# EAGLE schematic shield (EAGLE 6.5.0)

## Sheet 1 of 4: Supply
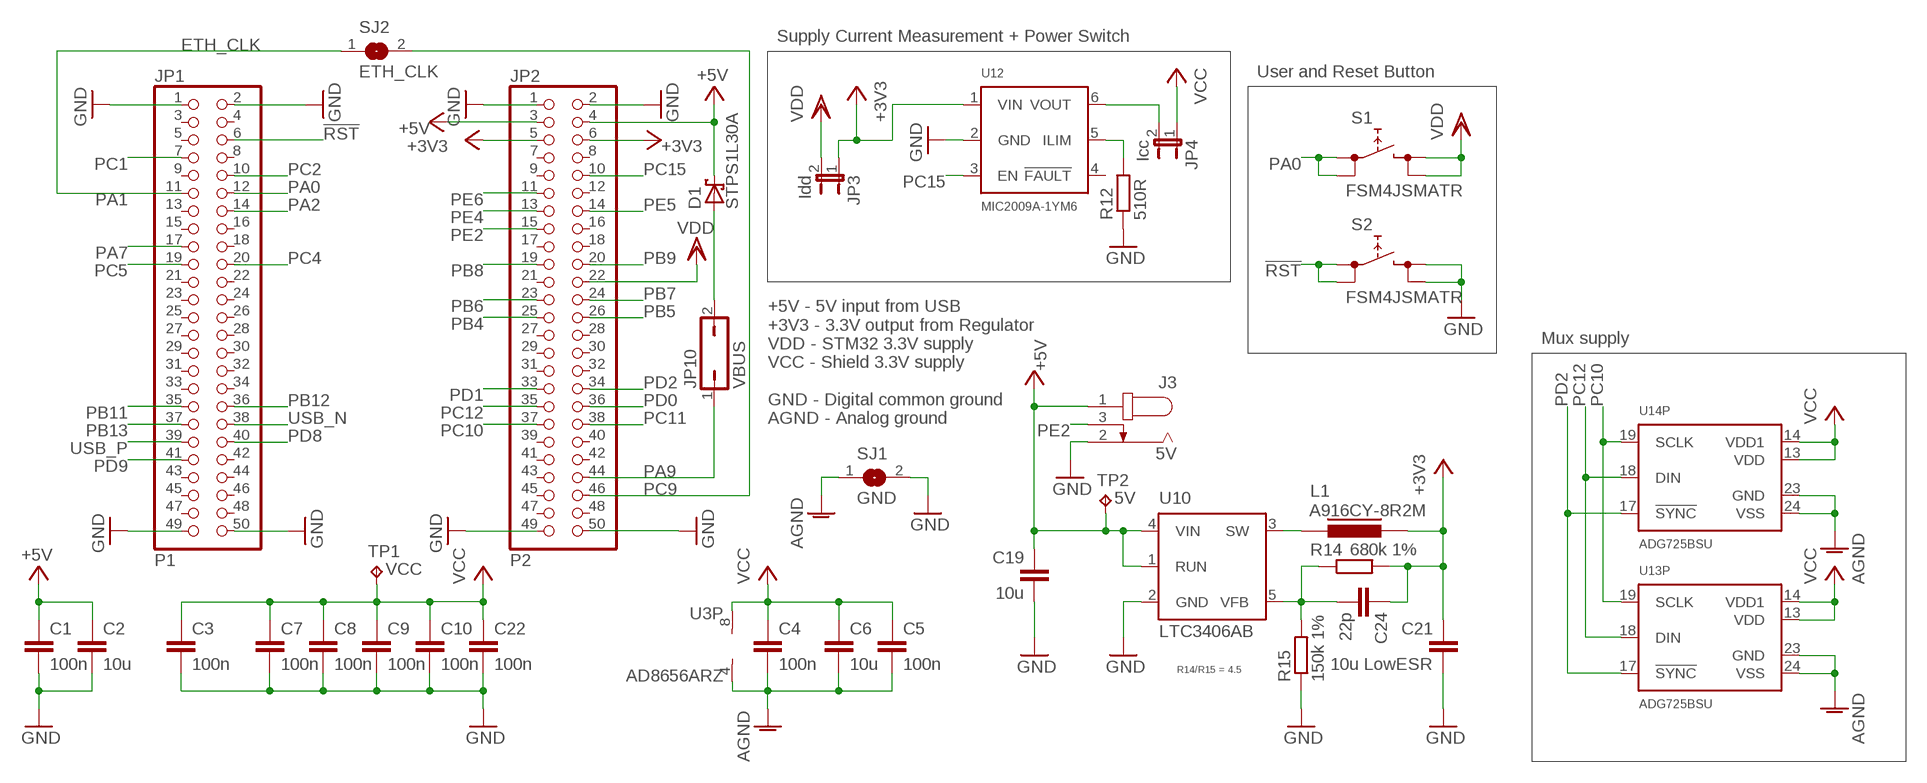
[diagram p0: schematic, sheet 1]

### Parts
C1  100n  C-EUC0603  [C0603]
C2  10u  C-EUC0603  [C0603]
C3  100n  C-EUC0603  [C0603]
C4  100n  C-EUC0603  [C0603]
C5  100n  C-EUC0603  [C0603]
C6  10u  C-EUC0603  [C0603]
C7  100n  C-EUC0603  [C0603]
C8  100n  C-EUC0603  [C0603]
C9  100n  C-EUC0603  [C0603]
C10  100n  C-EUC0603  [C0603]
C19  10u  C-EUC3216  [C3216]
C21  10u LowESR  C-EUC3216  [C3216]
C22  100n  C-EUC0603  [C0603]
C24  22p  C-EUC0603  [C0603]
D1  STPS1L30A  [DO214AC]
J3  5V  JACK-PLUG-S2.5  [JACK-SMD2.5]
JP1  P1  PINHD-2X25-F  [2X25-F]
JP2  P2  PINHD-2X25-F  [2X25-F]
JP3  Idd  JP1E  [JP1]
JP4  Icc  JP1E  [JP1]
JP10  VBUS  JP1Q  [JP1]
L1  A916CY-8R2M  [D63CB]
R12  510R  R-EU_R0603  [R0603]
R14  680k 1%  R-EU_R0603  [R0603]
R15  150k 1%  R-EU_R0603  [R0603]
S1  FSM4JSMATR  [FSM]
S2  FSM4JSMATR  [FSM]
SJ1  GND  SJ  [SJ]
SJ2  ETH_CLK  SJ  [SJ]
TP1  TPTP20R  [TP20R]
TP2  TPTP20R  [TP20R]
U3  AD8656ARZ  [SOIC8]
U10  LTC3406AB  [TSOT23-5]
U12  MIC2009A-1YM6  [SOT23-6]
U13  ADG725BSU  [TQFP48]
U14  ADG725BSU  [TQFP48]

### Nets
!RST: JP1.6 S2.1 S2.2
+3V3 [supply]: C21.1 C24.1 JP2.5 JP2.6 JP3.1 L1.2 R14.2 U12.1(VIN)
+5V [supply]: C1.1 C2.1 C19.1 D1.C J3.1 JP2.3 JP2.4 TP2.TP U10.1(RUN) U10.4(VIN) ; also sheet 4
AGND [supply]: C4.2 C5.2 C6.2 SJ1.1 U3.4(P:V-) U13.23(P:GND) U13.24(P:VSS) U14.23(P:GND) U14.24(P:VSS) ; also sheet 2
ETH_CLK: JP1.11 SJ2.1 ; also sheet 4
GND [supply]: C1.2 C2.2 C3.2 C7.2 C8.2 C9.2 C10.2 C19.2 C21.2 C22.2 J3.2 JP1.1 JP1.2 JP1.49 JP1.50 JP2.1 JP2.2 JP2.49 JP2.50 R12.1 R15.1 S2.3 S2.4 SJ1.2 U10.2(GND) U12.2(GND) ; also sheet 2,3,4
N$36: JP4.2 U12.6(VOUT)
N$37: D1.A JP10.2
N$38: R12.2 U12.5(ILIM)
N$40 [supply]: C24.2 R14.1 R15.2 U10.5(VFB)
N$41 [supply]: L1.1 U10.3(SW)
PA0: JP1.12 S1.1 S1.2
PA2: JP1.14 ; also sheet 4
PA7: JP1.17 ; also sheet 4
PA9: JP2.44 JP10.1
PB4: JP2.25 ; also sheet 2
PB5: JP2.26 ; also sheet 2
PB6: JP2.23 ; also sheet 2,3,4
PB7: JP2.24 ; also sheet 2
PB8: JP2.19 ; also sheet 2
PB9: JP2.20 ; also sheet 2,3,4
PB11: JP1.35 ; also sheet 4
PB12: JP1.36 ; also sheet 4
PB13: JP1.37 ; also sheet 4
PC1: JP1.7 ; also sheet 4
PC2: JP1.10 ; also sheet 2
PC4: JP1.20 ; also sheet 4
PC5: JP1.19 ; also sheet 4
PC9: JP2.46 SJ2.2
PC10: JP2.37 U13.19(P:SCLK) U14.19(P:SCLK) ; also sheet 3
PC11: JP2.38 ; also sheet 3
PC12: JP2.35 U13.18(P:DIN) U14.18(P:DIN) ; also sheet 3
PC15: JP2.10 U12.3(EN)
PD0: JP2.36 ; also sheet 3
PD1: JP2.33 ; also sheet 3
PD2: JP2.34 U13.17(P:!SYNC) U14.17(P:!SYNC)
PD8: JP1.40 ; also sheet 4
PD9: JP1.41 ; also sheet 4
PE2: J3.3 JP2.15
PE4: JP2.13 ; also sheet 2
PE5: JP2.14 ; also sheet 2
PE6: JP2.11 ; also sheet 2
USB_N: JP1.38 ; also sheet 4
USB_P: JP1.39 ; also sheet 4
VCC [supply]: C3.1 C4.1 C5.1 C6.1 C7.1 C8.1 C9.1 C10.1 C22.1 JP4.1 TP1.TP U3.8(P:V+) U13.13(P:VDD) U13.14(P:VDD1) U14.13(P:VDD) U14.14(P:VDD1) ; also sheet 2,3,4
VDD [supply]: JP2.22 JP3.2 S1.3 S1.4 ; also sheet 4
Unconnected: JP1.3 JP1.4 JP1.5 JP1.8 JP1.9 JP1.13 JP1.15 JP1.16 JP1.18 JP1.21 JP1.22 JP1.23 JP1.24 JP1.25 JP1.26 JP1.27 JP1.28 JP1.29 JP1.30 JP1.31 JP1.32 JP1.33 JP1.34 JP1.42 JP1.43 JP1.44 JP1.45 JP1.46 JP1.47 JP1.48 JP2.7 JP2.8 JP2.9 JP2.12 JP2.16 JP2.17 JP2.18 JP2.21 JP2.27 JP2.28 JP2.29 JP2.30 JP2.31 JP2.32 JP2.39 JP2.40 JP2.41 JP2.42 JP2.43 JP2.45 JP2.47 JP2.48 U12.4(!FAULT)

### Notes on the sheet
- Supply Current Measurement + Power Switch
- User and Reset Button
- PA1
- Mux supply
- +5V - 5V input from USB
  +3V3 - 3.3V output from Regulator
  VDD - STM32 3.3V supply
  VCC - Shield 3.3V supply
  
  GND - Digital common ground
  AGND - Analog ground
- R14/R15 = 4.5

## Sheet 2 of 4: AD5933
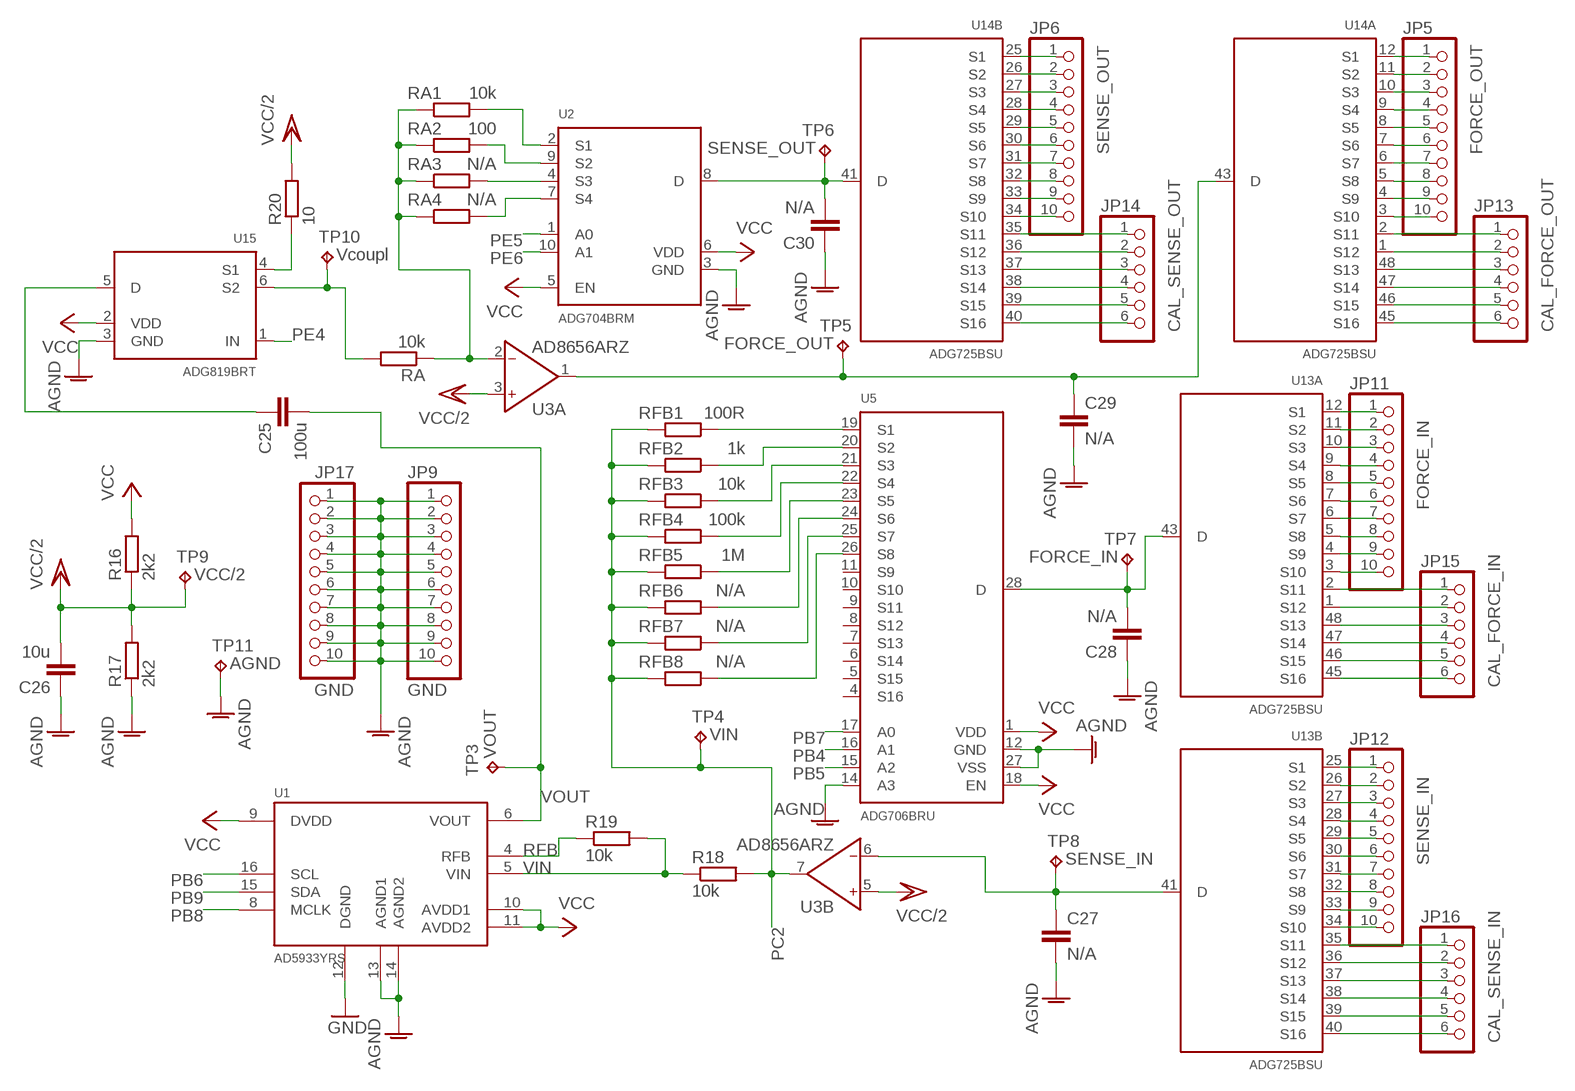
[diagram p1: schematic, sheet 2]

### Parts
C25  100u  C-EUC1206  [C1206]
C26  10u  C-EUC0603  [C0603]
C27  N/A  C-EUC0805  [C0805]
C28  N/A  C-EUC0805  [C0805]
C29  N/A  C-EUC0805  [C0805]
C30  N/A  C-EUC0805  [C0805]
JP5  FORCE_OUT  PINHD-1X10  [1X10]
JP6  SENSE_OUT  PINHD-1X10  [1X10]
JP9  GND  PINHD-1X10  [1X10]
JP11  FORCE_IN  PINHD-1X10  [1X10]
JP12  SENSE_IN  PINHD-1X10  [1X10]
JP13  CAL_FORCE_OUT  PINHD-1X6  [1X06]
JP14  CAL_SENSE_OUT  PINHD-1X6  [1X06]
JP15  CAL_FORCE_IN  PINHD-1X6  [1X06]
JP16  CAL_SENSE_IN  PINHD-1X6  [1X06]
JP17  GND  PINHD-1X10  [1X10]
R16  2k2  R-EU_R0603  [R0603]
R17  2k2  R-EU_R0603  [R0603]
R18  10k  R-EU_R0603  [R0603]
R19  10k  R-EU_R0603  [R0603]
R20  10  R-EU_R0603  [R0603]
RA  10k  R-EU_R0603  [R0603]
RA1  10k  R-EU_R0603  [R0603]
RA2  100  R-EU_R0603  [R0603]
RA3  N/A  R-EU_R0603  [R0603]
RA4  N/A  R-EU_R0603  [R0603]
RFB1  100R  R-EU_R0603  [R0603]
RFB2  1k  R-EU_R0603  [R0603]
RFB3  10k  R-EU_R0603  [R0603]
RFB4  100k  R-EU_R0603  [R0603]
RFB5  1M  R-EU_R0603  [R0603]
RFB6  N/A  R-EU_R0603  [R0603]
RFB7  N/A  R-EU_R0603  [R0603]
RFB8  N/A  R-EU_R0603  [R0603]
TP3  TPTP20R  [TP20R]
TP4  TPTP20R  [TP20R]
TP5  TPTP20R  [TP20R]
TP6  TPTP20R  [TP20R]
TP7  TPTP20R  [TP20R]
TP8  TPTP20R  [TP20R]
TP9  TPTP20R  [TP20R]
TP10  TPTP20R  [TP20R]
TP11  TPPAD1-13  [P1-13]
U1  AD5933YRS  [SSOP16]
U2  ADG704BRM  [MSOP10]
U5  ADG706BRU  [TSSOP28]
U15  ADG819BRT  [SOT23-6]

### Nets
AGND [supply]: C26.1 C27.2 C28.1 C29.2 C30.1 JP9.1 JP9.2 JP9.3 JP9.4 JP9.5 JP9.6 JP9.7 JP9.8 JP9.9 JP9.10 JP17.1 JP17.2 JP17.3 JP17.4 JP17.5 JP17.6 JP17.7 JP17.8 JP17.9 JP17.10 R17.1 TP11.TP U1.13(AGND1) U1.14(AGND2) U2.3(GND) U5.12(GND) U5.14(A3) U5.27(VSS) U15.3(GND) ; also sheet 1
GND [supply]: U1.12(DGND) ; also sheet 1,3,4
N$2: RA.2 TP10.TP U15.6(S2)
N$3 [analog]: RA1.1 RA2.1 RA3.1 RA4.1 RA.1 U3.2(A:IN-)
N$4 [analog]: RA3.2 U2.4(S3)
N$5 [analog]: RA4.2 U2.7(S4)
N$6 [analog]: RFB1.1 U5.19(S1)
N$7 [analog]: RFB2.1 U5.20(S2)
N$8 [analog]: RFB3.1 U5.21(S3)
N$9 [analog]: RFB4.1 U5.22(S4)
N$10 [analog]: RFB5.1 U5.23(S5)
N$11 [analog]: RFB6.1 U5.24(S6)
N$12 [analog]: C27.1 TP8.TP U3.6(B:IN-) U13.41(B:D)
N$13 [analog]: C28.2 TP7.TP U5.28(D) U13.43(A:D)
N$14 [analog]: C29.1 TP5.TP U3.1(A:OUT) U14.43(A:D)
N$15 [analog]: C30.2 TP6.TP U2.8(D) U14.41(B:D)
N$16 [analog]: JP12.1 U13.25(B:S1)
N$17 [analog]: JP12.2 U13.26(B:S2)
N$18 [analog]: JP12.3 U13.27(B:S3)
N$19 [analog]: JP12.4 U13.28(B:S4)
N$42 [analog]: JP12.5 U13.29(B:S5)
N$43 [analog]: JP12.6 U13.30(B:S6)
N$44 [analog]: JP12.7 U13.31(B:S7)
N$45 [analog]: JP12.8 U13.32(B:S8)
N$46 [analog]: JP12.9 U13.33(B:S9)
N$47 [analog]: JP12.10 U13.34(B:S10)
N$48 [analog]: JP11.1 U13.12(A:S1)
N$49 [analog]: JP11.2 U13.11(A:S2)
N$50 [analog]: JP11.3 U13.10(A:S3)
N$51 [analog]: JP11.4 U13.9(A:S4)
N$52 [analog]: JP11.5 U13.8(A:S5)
N$53 [analog]: JP11.6 U13.7(A:S6)
N$54 [analog]: JP11.7 U13.6(A:S7)
N$55 [analog]: JP11.8 U13.5(A:S8)
N$56 [analog]: JP11.9 U13.4(A:S9)
N$57 [analog]: JP11.10 U13.3(A:S10)
N$58 [analog]: JP5.1 U14.12(A:S1)
N$59 [analog]: JP5.2 U14.11(A:S2)
N$60 [analog]: JP5.3 U14.10(A:S3)
N$61 [analog]: JP5.4 U14.9(A:S4)
N$62 [analog]: JP5.5 U14.8(A:S5)
N$63 [analog]: JP5.6 U14.7(A:S6)
N$64 [analog]: JP5.7 U14.6(A:S7)
N$65 [analog]: JP5.8 U14.5(A:S8)
N$66 [analog]: JP5.9 U14.4(A:S9)
N$67 [analog]: JP5.10 U14.3(A:S10)
N$68 [analog]: JP6.1 U14.25(B:S1)
N$69 [analog]: JP6.2 U14.26(B:S2)
N$70 [analog]: JP6.3 U14.27(B:S3)
N$71 [analog]: JP6.4 U14.28(B:S4)
N$72 [analog]: JP6.5 U14.29(B:S5)
N$73 [analog]: JP6.6 U14.30(B:S6)
N$74 [analog]: JP6.7 U14.31(B:S7)
N$75 [analog]: JP6.8 U14.32(B:S8)
N$76 [analog]: JP6.9 U14.33(B:S9)
N$77 [analog]: JP6.10 U14.34(B:S10)
N$78 [analog]: JP13.1 U14.2(A:S11)
N$79 [analog]: JP13.2 U14.1(A:S12)
N$80 [analog]: JP13.3 U14.48(A:S13)
N$81 [analog]: JP13.4 U14.47(A:S14)
N$82 [analog]: JP13.5 U14.46(A:S15)
N$83 [analog]: JP13.6 U14.45(A:S16)
N$84 [analog]: JP14.1 U14.35(B:S11)
N$85 [analog]: JP14.2 U14.36(B:S12)
N$86 [analog]: JP14.3 U14.37(B:S13)
N$87 [analog]: JP14.4 U14.38(B:S14)
N$88 [analog]: JP14.5 U14.39(B:S15)
N$89 [analog]: JP14.6 U14.40(B:S16)
N$90 [analog]: JP15.1 U13.2(A:S11)
N$91 [analog]: JP15.2 U13.1(A:S12)
N$92 [analog]: JP15.3 U13.48(A:S13)
N$93 [analog]: JP15.4 U13.47(A:S14)
N$94 [analog]: JP15.5 U13.46(A:S15)
N$95 [analog]: JP15.6 U13.45(A:S16)
N$96 [analog]: JP16.1 U13.35(B:S11)
N$97 [analog]: JP16.2 U13.36(B:S12)
N$98 [analog]: JP16.3 U13.37(B:S13)
N$99 [analog]: JP16.4 U13.38(B:S14)
N$100 [analog]: JP16.5 U13.39(B:S15)
N$101 [analog]: JP16.6 U13.40(B:S16)
N$102 [analog]: RA2.2 U2.9(S2)
N$103 [analog]: RA1.2 U2.2(S1)
N$104 [analog]: RFB7.1 U5.25(S7)
N$105 [analog]: RFB8.1 U5.26(S8)
N$107: C25.1 U15.5(D)
N$108 [analog]: R20.1 U15.4(S1)
PB4: U5.16(A1) ; also sheet 1
PB5: U5.15(A2) ; also sheet 1
PB6: U1.16(SCL) ; also sheet 1,3,4
PB7: U5.17(A0) ; also sheet 1
PB8: U1.8(MCLK) ; also sheet 1
PB9: U1.15(SDA) ; also sheet 1,3,4
PC2: R18.2 RFB1.2 RFB2.2 RFB3.2 RFB4.2 RFB5.2 RFB6.2 RFB7.2 RFB8.2 TP4.TP U3.7(B:OUT) ; also sheet 1
PE4: U15.1(IN) ; also sheet 1
PE5: U2.1(A0) ; also sheet 1
PE6: U2.10(A1) ; also sheet 1
RFB [analog]: R19.1 U1.4(RFB)
VCC [supply]: R16.2 U1.9(DVDD) U1.10(AVDD1) U1.11(AVDD2) U2.5(EN) U2.6(VDD) U5.1(VDD) U5.18(EN) U15.2(VDD) ; also sheet 1,3,4
VCC/2 [analog]: C26.2 R16.1 R17.2 R20.2 TP9.TP U3.3(A:IN+) U3.5(B:IN+)
VIN [analog]: R18.1 R19.2 U1.5(VIN)
VOUT [analog]: C25.2 TP3.TP U1.6(VOUT)
Unconnected: U5.4(S16) U5.5(S15) U5.6(S14) U5.7(S13) U5.8(S12) U5.9(S11) U5.10(S10) U5.11(S9)

## Sheet 3 of 4: Memory
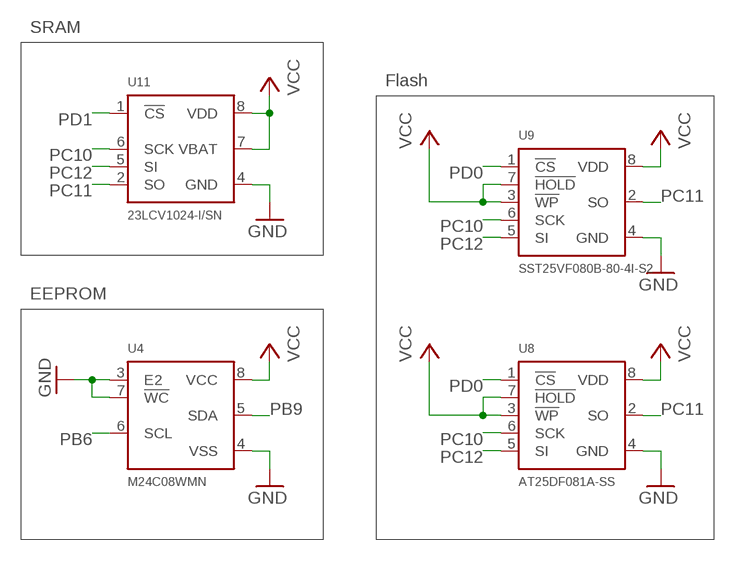
[diagram p2: schematic, sheet 3]

### Parts
U4  M24C08WMN  [SO8]
U8  AT25DF081A-SS  [SO8]
U9  SST25VF080B-80-4I-S2  [SOIC8]
U11  23LCV1024-I/SN  [SO8]

### Nets
GND [supply]: U4.3(E2) U4.4(VSS) U4.7(!WC) U8.4(GND) U9.4(GND) U11.4(GND) ; also sheet 1,2,4
PB6: U4.6(SCL) ; also sheet 1,2,4
PB9: U4.5(SDA) ; also sheet 1,2,4
PC10: U8.6(SCK) U9.6(SCK) U11.6(SCK) ; also sheet 1
PC11: U8.2(SO) U9.2(SO) U11.2(SO) ; also sheet 1
PC12: U8.5(SI) U9.5(SI) U11.5(SI) ; also sheet 1
PD0: U8.1(!CS) U9.1(!CS) ; also sheet 1
PD1: U11.1(!CS) ; also sheet 1
VCC [supply]: U4.8(VCC) U8.3(!WP) U8.7(!HOLD) U8.8(VDD) U9.3(!WP) U9.7(!HOLD) U9.8(VDD) U11.7(VBAT) U11.8(VDD) ; also sheet 1,2,4

### Notes on the sheet
- SRAM
- Flash
- EEPROM

## Sheet 4 of 4: Comm
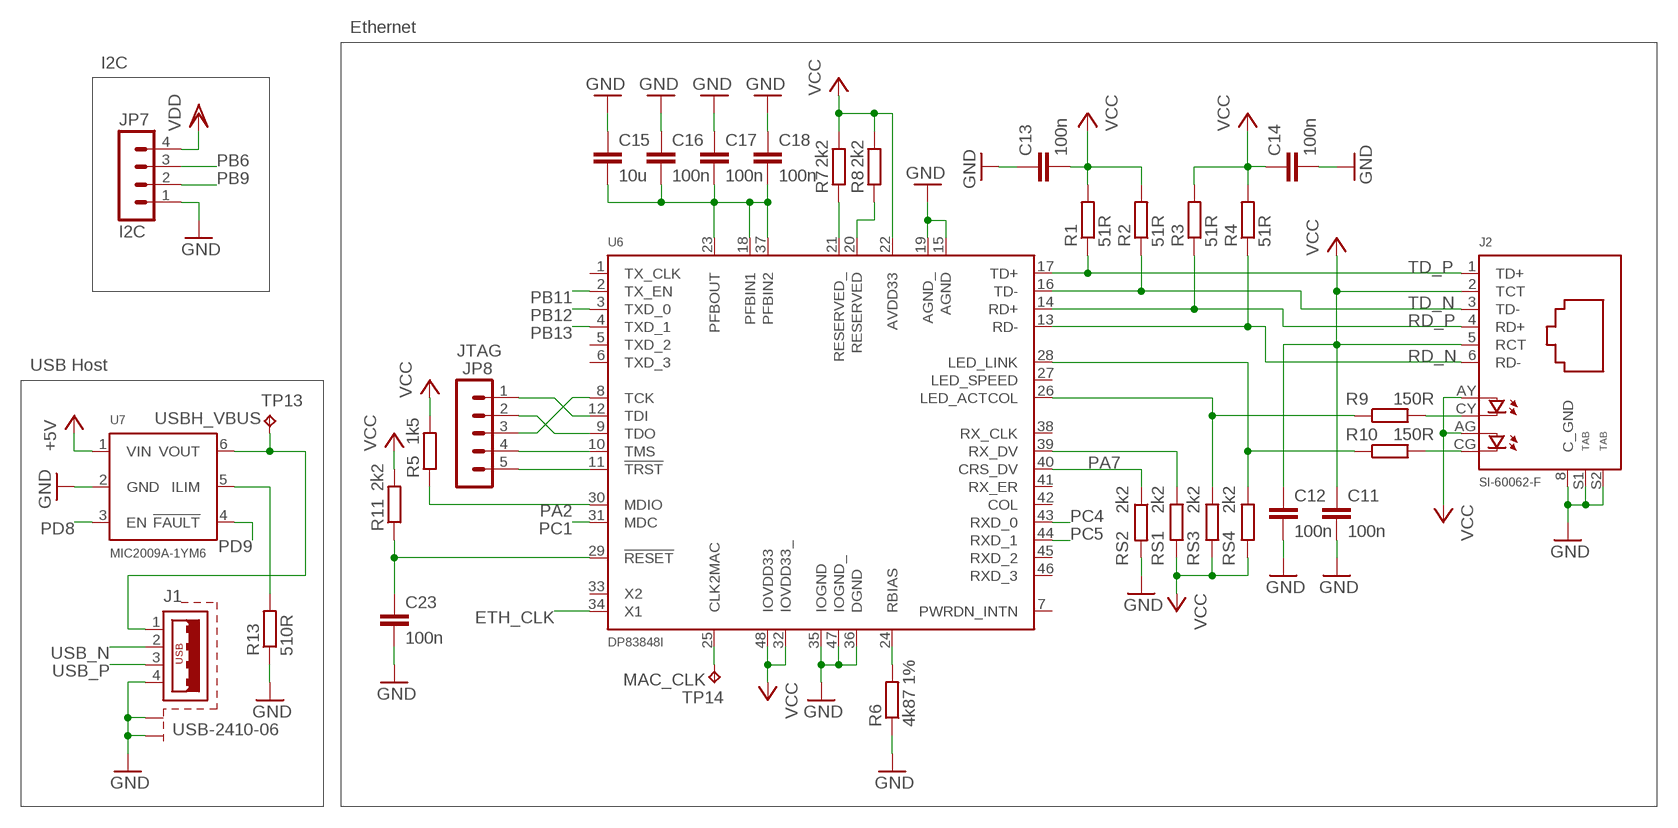
[diagram p3: schematic, sheet 4]

### Parts
C11  100n  C-EUC0603  [C0603]
C12  100n  C-EUC0603  [C0603]
C13  100n  C-EUC0603  [C0603]
C14  100n  C-EUC0603  [C0603]
C15  10u  C-EUC0603  [C0603]
C16  100n  C-EUC0603  [C0603]
C17  100n  C-EUC0603  [C0603]
C18  100n  C-EUC0603  [C0603]
C23  100n  C-EUC0603  [C0603]
J1  USB-2410-06  [USB-2410-06]
J2  SI-60062-F  [SI-60062-F]
JP7  I2C  MA04-1  [MA04-1]
JP8  JTAG  MA05-1  [MA05-1]
R1  51R  R-EU_R0603  [R0603]
R2  51R  R-EU_R0603  [R0603]
R3  51R  R-EU_R0603  [R0603]
R4  51R  R-EU_R0603  [R0603]
R5  1k5  R-EU_R0603  [R0603]
R6  4k87 1%  R-EU_R0603  [R0603]
R7  2k2  R-EU_R0603  [R0603]
R8  2k2  R-EU_R0603  [R0603]
R9  150R  R-EU_R0603  [R0603]
R10  150R  R-EU_R0603  [R0603]
R11  2k2  R-EU_R0603  [R0603]
R13  510R  R-EU_R0603  [R0603]
RS1  2k2  R-EU_R0603  [R0603]
RS2  2k2  R-EU_R0603  [R0603]
RS3  2k2  R-EU_R0603  [R0603]
RS4  2k2  R-EU_R0603  [R0603]
TP13  TPTP20R  [TP20R]
TP14  TPTP20R  [TP20R]
U6  DP83848I  [LQFP48]
U7  MIC2009A-1YM6  [SOT23-6]

### Nets
+5V [supply]: U7.1(VIN) ; also sheet 1
ETH_CLK: U6.34(X1) ; also sheet 1
GND [supply]: C11.2 C12.2 C13.1 C14.2 C15.1 C16.1 C17.1 C18.1 C23.2 J1.4(GND) J1.S1 J1.S2 J2.8(C_GND) J2.S1(TAB1) J2.S2(TAB2) JP7.1 R6.1 R13.1 RS2.2 U6.15(AGND) U6.19(AGND_) U6.35(IOGND) U6.36(DGND) U6.47(IOGND_) U7.2(GND) ; also sheet 1,2,3
N$20: J2.CY R9.2
N$21: RS1.2 U6.39(RX_DV)
N$22: R9.1 RS3.2 U6.26(LED_ACTCOL)
N$23: R10.1 RS4.2 U6.28(LED_LINK)
N$24: C15.2 C16.2 C17.2 C18.2 U6.18(PFBIN1) U6.23(PFBOUT) U6.37(PFBIN2)
N$25: J2.CG R10.2
N$26 [supply]: J1.1(VCC) TP13.TP U7.6(VOUT)
N$27: JP8.1 U6.12(TDI)
N$28: JP8.2 U6.9(TDO)
N$29: JP8.3 U6.8(TCK)
N$30: JP8.4 U6.10(TMS)
N$31: JP8.5 U6.11(!TRST)
N$32: C23.1 R11.1 U6.29(!RESET)
N$33: R6.2 U6.24(RBIAS)
N$34: R8.1 U6.20(RESERVED)
N$35: R7.1 U6.21(RESERVED_)
N$39: R13.2 U7.5(ILIM)
N$106: TP14.TP U6.25(CLK2MAC)
PA2: R5.1 U6.30(MDIO) ; also sheet 1
PA7: RS2.1 U6.40(CRS_DV) ; also sheet 1
PB6: JP7.3 ; also sheet 1,2,3
PB9: JP7.2 ; also sheet 1,2,3
PB11: U6.2(TX_EN) ; also sheet 1
PB12: U6.3(TXD_0) ; also sheet 1
PB13: U6.4(TXD_1) ; also sheet 1
PC1: U6.31(MDC) ; also sheet 1
PC4: U6.43(RXD_0) ; also sheet 1
PC5: U6.44(RXD_1) ; also sheet 1
PD8: U7.3(EN) ; also sheet 1
PD9: U7.4(!FAULT) ; also sheet 1
RD_N: J2.6(RD-) R4.1 U6.13(RD-)
RD_P: J2.4(RD+) R3.1 U6.14(RD+)
TD_N: J2.3(TD-) R2.1 U6.16(TD-)
TD_P: J2.1(TD+) R1.1 U6.17(TD+)
USB_N: J1.2(D-) ; also sheet 1
USB_P: J1.3(D+) ; also sheet 1
VCC [supply]: C11.1 C12.1 C13.2 C14.1 J2.2(TCT) J2.5(RCT) J2.AG J2.AY R1.2 R2.2 R3.2 R4.2 R5.2 R7.2 R8.2 R11.2 RS1.1 RS3.1 RS4.1 U6.22(AVDD33) U6.32(IOVDD33_) U6.48(IOVDD33) ; also sheet 1,2,3
VDD [supply]: JP7.4 ; also sheet 1
Unconnected: U6.1(TX_CLK) U6.5(TXD_2) U6.6(TXD_3) U6.7(PWRDN_INTN) U6.27(LED_SPEED) U6.33(X2) U6.38(RX_CLK) U6.41(RX_ER) U6.42(COL) U6.45(RXD_2) U6.46(RXD_3)

### Notes on the sheet
- Ethernet
- I2C
- USB Host

## Library data of the parts
C1-C19 C21-C30 = rcl:C-EU: CAPACITOR, European symbol
D1 = parts:STPS1L30: Low Drop Power Schottky Rectifier 1A, 30V; RS: 485-8061
J1 = parts:USB-2410-06: Lumberg 2410 06 USB-A connector; RS: 737-8791
J2 = parts:SI-60062-F: MagJack 10/100 Base-T Ethernet connector; RS: 741-8489
J3 = parts:JACK-PLUG: DC Power Jack Power Jack, DC, Right Angle 2.5A, 16VDC; RS: 476-157
JP1 JP2 = parts:PINHD-2X25: PIN HEADER; RS: 766-6660
JP3 JP4 = jumper:JP1E: JUMPER
JP5 JP6 JP9 JP11 JP12 JP17 = pinhead:PINHD-1X10: PIN HEADER
JP7 = con-lstb:MA04-1: PIN HEADER; OC_FARNELL: unknown; OC_NEWARK: unknown
JP8 = con-lstb:MA05-1: PIN HEADER; OC_FARNELL: unknown; OC_NEWARK: unknown
JP10 = jumper:JP1Q: JUMPER
JP13-JP16 = pinhead:PINHD-1X6: PIN HEADER
L1 = parts:A916CY: Fixed Inductors for Surface Mounting Toko inductors, 2.0~100µH, 3.5mm max height; INDUCTANCE: 8.2u; RS: 752-1361
R1-R20 RA RA1-RA4 RFB1-RFB8 RS1-RS4 = rcl:R-EU_: RESISTOR, European symbol
S1 S2 = parts:FSM4JSMATR: Micro Miniature Pushbutton Switch Tyco Electronics FSM series surface mount switch; RS: 718-2455
SJ1 SJ2 = jumper:SJ: SMD solder JUMPER
TP1 = testpad:TP: Test pad; TP_SIGNAL_NAME: VCC
TP2 = testpad:TP: Test pad; TP_SIGNAL_NAME: 5V
TP3 = testpad:TP: Test pad; TP_SIGNAL_NAME: VOUT
TP4 = testpad:TP: Test pad; TP_SIGNAL_NAME: VIN
TP5 = testpad:TP: Test pad; TP_SIGNAL_NAME: FORCE_OUT
TP6 = testpad:TP: Test pad; TP_SIGNAL_NAME: SENSE_OUT
TP7 = testpad:TP: Test pad; TP_SIGNAL_NAME: FORCE_IN
TP8 = testpad:TP: Test pad; TP_SIGNAL_NAME: SENSE_IN
TP9 = testpad:TP: Test pad; TP_SIGNAL_NAME: VCC/2
TP10 = testpad:TP: Test pad; TP_SIGNAL_NAME: Vcoupl
TP11 = testpad:TP: Test pad; TP_SIGNAL_NAME: AGND
TP13 = testpad:TP: Test pad; TP_SIGNAL_NAME: USBH_VBUS
TP14 = testpad:TP: Test pad; TP_SIGNAL_NAME: MAC_CLK
U1 = parts:AD5933: 1 MSPS, 12-Bit Impedance Converter, Network Analyzer Applications: Electrochemical analysis Bioelectrical impedance analysis Impedance spectroscopy Complex impedance measurement Corrosion monitoring and protection equipment Biomedical and automotive sensors Proximity sensing Nondestructive testing Material property analysis Fuel/battery cell condition monitoring source <http://www.analog.com/static/imported-files/data_sheets/AD5933.pdf>; RS: 709-4816
U2 = parts:ADG704: CMOS Low Voltage 4 Ω, 4-Channel Multiplexer Source: ADG704.pdf; RS: 523-8761
U3 = parts:AD8656: Low Noise, Precision CMOS Amplifier The AD8655 is a single version; RS: 759-1370
U4 = parts:M24C08: 8-Kbit serial I²C bus EEPROM; RS: 415-1180; VCC: 2.5V - 5.5V
U5 = parts:ADG706: CMOS, +1.8 V to +5.5 V/±2.5 V, 2.5 Ω Low-Voltage, 16-Channel Multiplexer Source: ADG706.pdf; RS: 523-6478
U6 = parts:DP83848: PHYTER® - Industrial Temperature Single Port 10/100 Mb/s Ethernet Physical Layer Transceiver http://www.ti.com/product/dp83848i; MPN: DP83848IVV; RS: 651-5766
U7 U12 = parts:MIC2009A-1: Adjustable Current Limiting Power Distribution Switch Current limit 0.1A-0.9A, Enable signal active high; RS: 727-4832
U8 = parts:AT25DF081A: 8-MBit 2.7V Minimum Serial Peripheral Interface Serial Flash Memory; RS: 738-0094
U9 = parts:SST25VF080B: 8 MBit SPI Serial Flash; RS: 736-9258
U10 = parts:LTC3406: 1.5MHz, 600mA Synchronous Step-Down Regulator in ThinSOT; RS: 761-9409
U11 = parts:23LCV1024: 1 Mbit SPI Serial SRAM with Battery Backup and SDI Interface; RS: 792-8738
U13 U14 = parts:ADG725: 16-/32-Channel, Serially Controlled 4 Ω, 1.8 V to 5.5 V, ±2.5 V, Analog Multiplexers; RS: 538-6747
U15 = parts:ADG819: 0.5 Ω, CMOS, 1.8 V to 5.5 V, 2:1 Mux/SPDT Switch; RS: 796-8956

## Net classes
1 supply: width 0.914 mm